# EAGLE design throughhole (EAGLE 7.5.0)
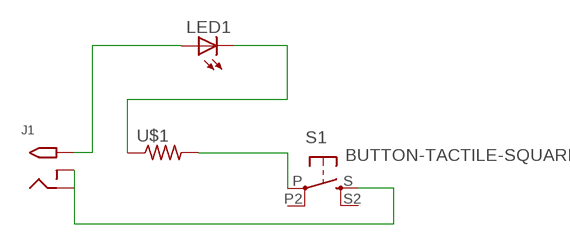
[diagram p0: schematic, sheet 1]

## Parts
J1  2.1MMJACKTHM  [PJ-102A]
LED1  LED5MM  [LED5MM]
S1  BUTTON-TACTILE-SQUARE  [BUTTON-TACTILE-SQUARE-ADAFRUIT1010]
U$1  RESISTORTH-1/4W-CARBON  [RESAD1160W55L680D260_HS]

## Nets
N$1: S1.P U$1.2
N$2: LED1.K(C) U$1.1
N$3: J1.TIP LED1.A
N$4: J1.RING J1.RING_SW S1.S
Unconnected: S1.P2(P1) S1.S2(S1)

## Library data of the parts
J1 = Lab2:2.1MMJACK: 2.1mm x 5.5mm THM DC jack with internal switch. Digikey part #PJ-102A, 4UCON part #05537 2.1mm x 5.5mm SMT DC jack with internal switch. Digikey part #PJ-002A-SMT, 4UCON part #03267 By microbuilder.eu & adafruit.com
LED1 = Lab2:LED: LED OSRAM: - CHIPLED LG R971, LG N971, LY N971, LG Q971, LY Q971, LO R971, LY R971 LH N974, LH R974 LS Q976, LO Q976, LY Q976 LO Q996 - Hyper CHIPLED LW Q18S LB Q993, LB Q99A, LB R99A - SideLED LS A670, LO A670, LY A670, LG A670, LP A670 LB A673, LV A673, LT A673, LW A673 LH A674 LY A675 LS A676, LA A676, LO A676, LY A676, LW A676 LS A679, LY A679, LG A679 - Hyper Micro SIDELED® LS Y876, LA Y876, LO Y876, LY Y876 LT Y87S - SmartLED LW L88C, LW L88S LB L89C, LB L89S, LG L890 LS L89K, LO L89K, LY L89K LS L896, LA L896, LO L896, LY L896 - TOPLED LS T670, LO T670, LY T670, LG T670, LP T670 LSG T670, LSP T670, LSY T670, LOP T670, LYG T670 LG T671, LOG T671, LSG T671 LB T673, LV T673, LT T673, LW T673 LH T674 LS T676, LA T676, LO T676, LY T676, LB T676, LH T676, LSB T676, LW T676 LB T67C, LV T67C, LT T67C, LS T67K, LO T67K, LY T67K, LW E67C LS E67B, LA E67B, LO E67B, LY E67B, LB E67C, LV E67C, LT E67C LW T67C LS T679, LY T679, LG T679 LS T770, LO T770, LY T770, LG T770, LP T770 LB T773, LV T773, LT T773, LW T773 LH T774 LS E675, LA E675, LY E675, LS T675 LS T776, LA T776, LO T776, LY T776, LB T776 LHGB T686 LT T68C, LB T68C - Hyper Mini TOPLED® LB M676 - Mini TOPLED Santana® LG M470 LS M47K, LO M47K, LY M47K Source: http://www.osram.convergy.de/
S1 = Lab2:BUTTON-TACTILE
U$1 = Lab2:RESISTOR

## Board
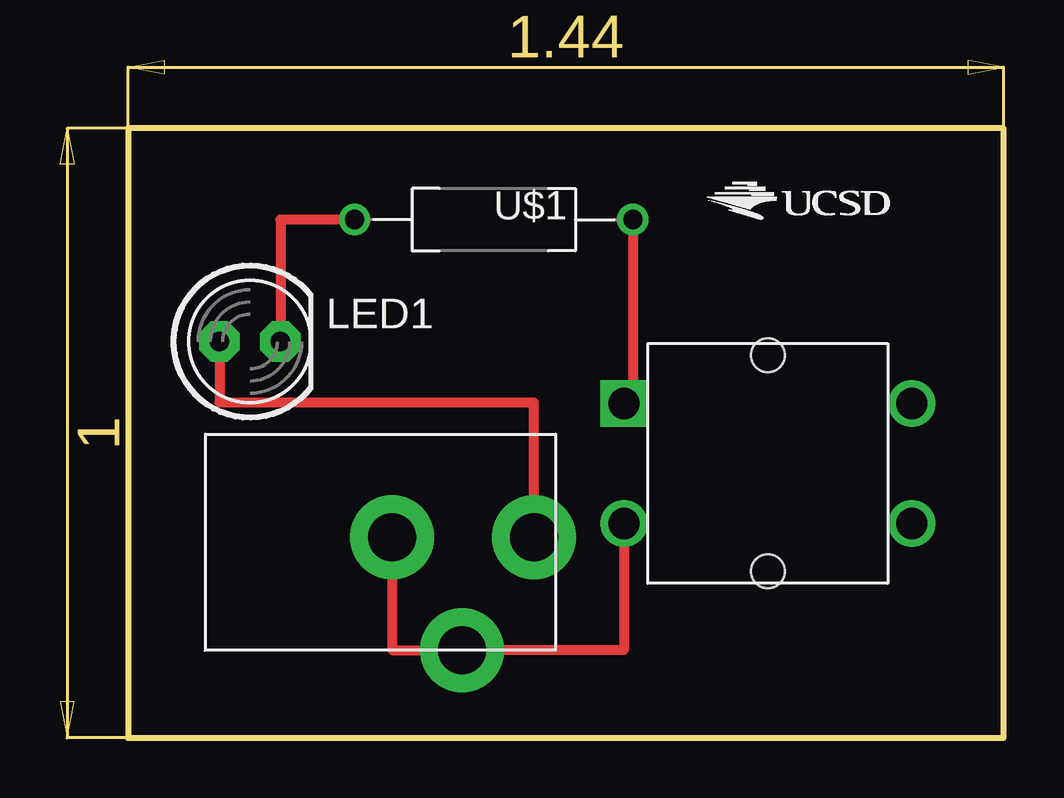
[diagram p1: board, top side]

Size 36.5 x 25.39 mm. Coordinates in mm from the lower left corner, seen from the top.
Outline: 0,0 36.5,0 36.5,25.39 0,25.39 0,0
Copper layers (1*16): Top 0.035mm / dielectric 1.5mm / Bottom 0.035mm
Design rules "default": minimum track width 10mil, minimum drill 24mil, track to track 8mil, track to pad 8mil, pad to pad 8mil, via to via 8mil, smd to smd 8mil, copper to edge 40mil, drill to drill 8mil, minimum pad ring 10mil, minimum via ring 8mil, stop-mask expansion 4mil, vias tented up to drill 0mil, thermal gap 10mil

### Footprints (pad centres in the part's own frame; a part is rotated, then mirrored left to right if it is on the bottom)
PJ-102A = drill 2 pad 3.5: RING -6.77,-4.345; RING_SW -3.87,-9.045; TIP -0.87,-4.345
LED5MM = drill 0.813 pad 1.676 octagon: A -1.27,0; K 1.27,0
BUTTON-TACTILE-SQUARE-ADAFRUIT1010 = drill 1.3 square: P -6,2.5 | drill 1.3: P2 6,2.5; S -6,-2.5; S2 6,-2.5 | hole 1.4: 0,4.5; 0,-4.5
RESAD1160W55L680D260_HS = drill 0.8 pad 1.2: 1 -5.8,0; 2 5.8,0

### Placement (x,y rotation side)
J1  17.78,12.7 0 top
LED1  5.08,16.51 0 top
S1  26.67,11.43 0 top
U$1  15.24,21.59 0 top
U$2  [UCSD_LOGO]  24.13,21.59 0 top

### Tracks (layer width: path | path; a pad name or v marks a point on that pad's centre or on a via)
N$1
  Top 0.406: U$1.2 21.04,13.93 S1.P
N$2
  Top 0.406: U$1.1 6.35,21.59 LED1.K
N$3
  Top 0.406: LED1.A 3.81,13.97 16.91,13.97 J1.TIP
N$4
  Top 0.406: J1.RING 11.01,3.65 J1.RING_SW 20.67,3.65 S1.S